# EAGLE design BminiMO (EAGLE 6.6.0)
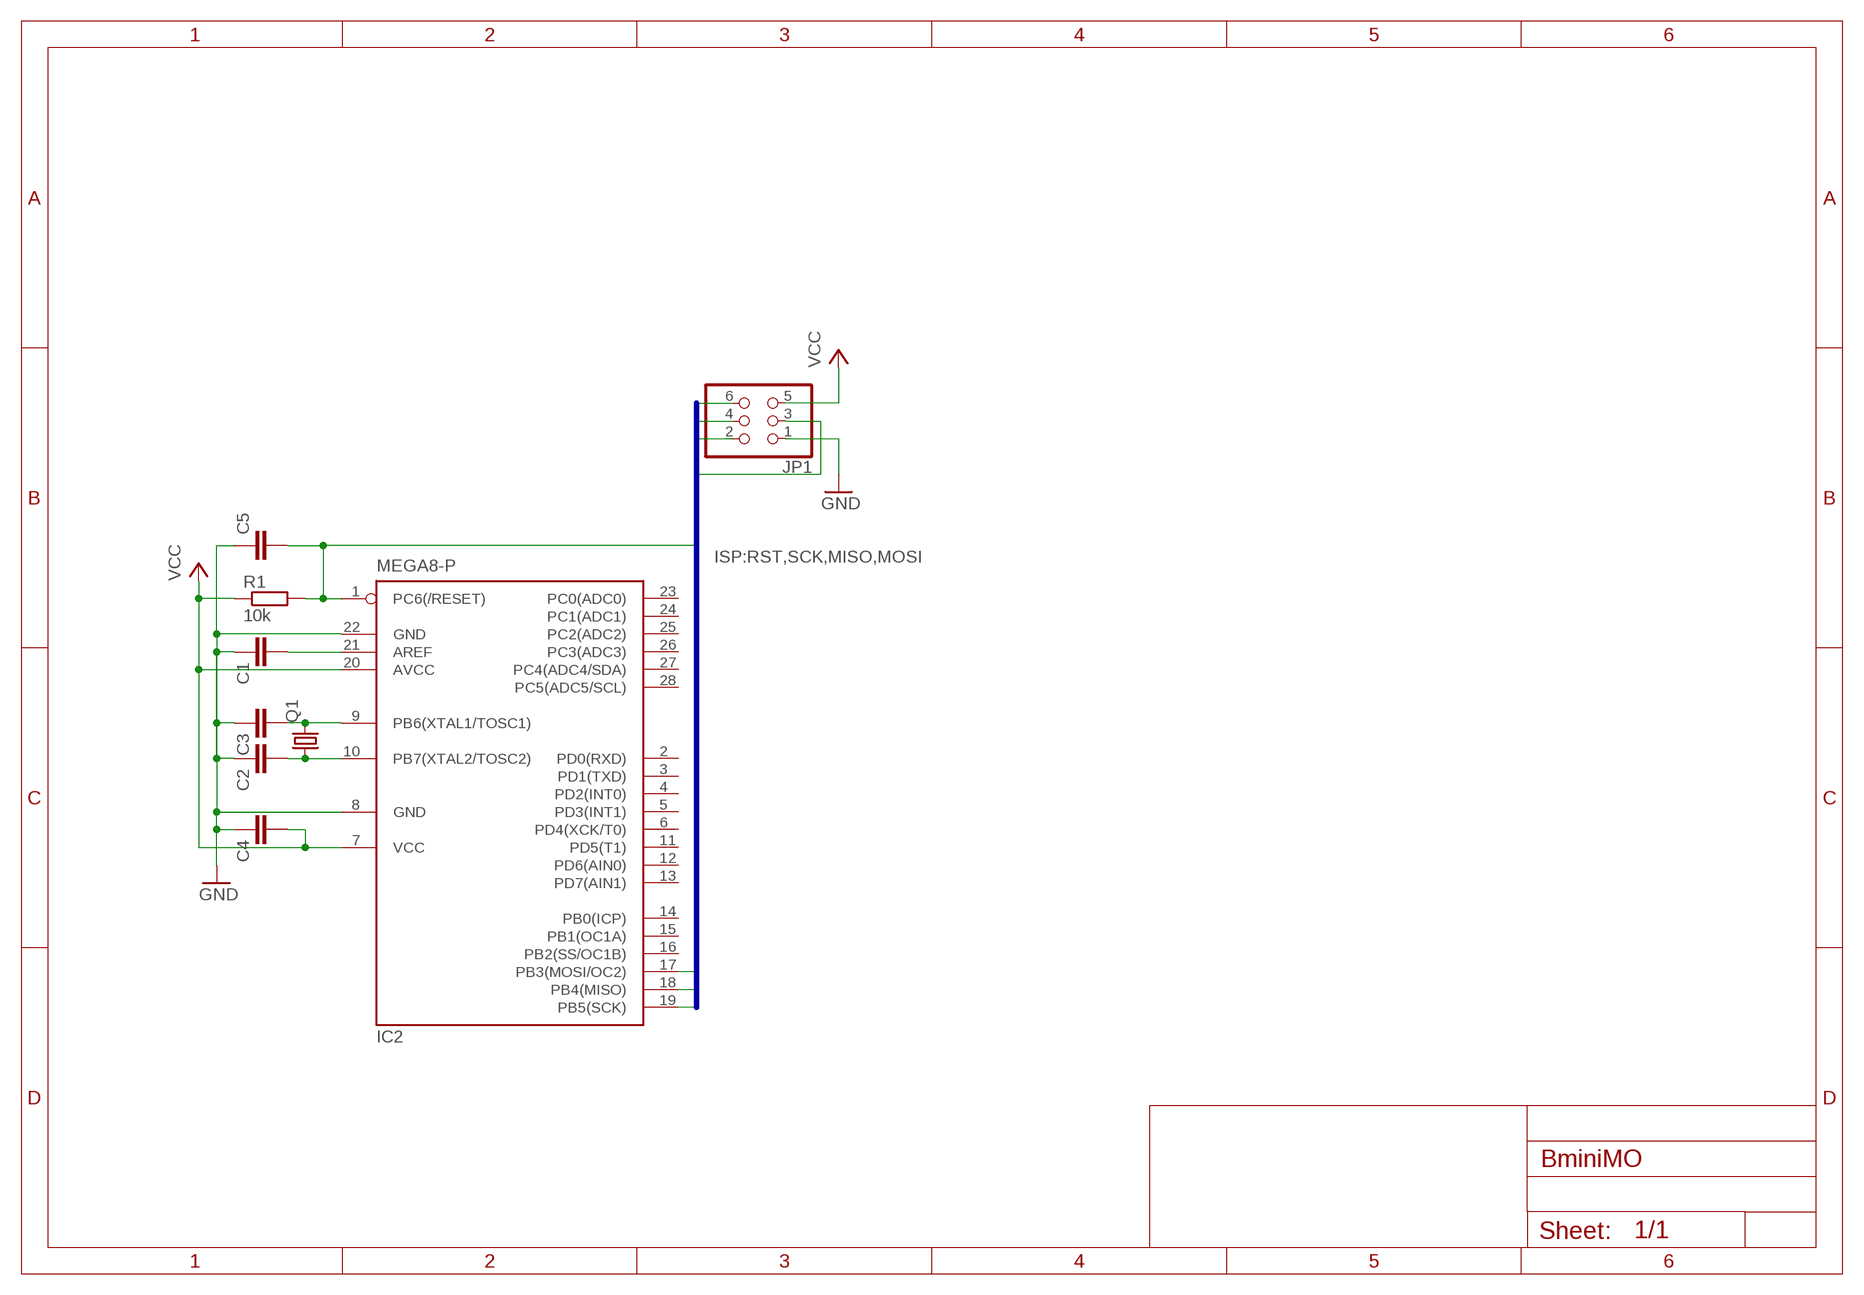
[diagram p0: schematic, sheet 1]

## Parts
C1  C-EU025-025X050  [C025-025X050]
C2  C-EU025-025X050  [C025-025X050]
C3  C-EU025-025X050  [C025-025X050]
C4  C-EU025-025X050  [C025-025X050]
C5  C-EU025-025X050  [C025-025X050]
IC2  MEGA8-P  [DIL28-3]
JP1  PINHD-2X3/90  [2X03/90]
Q1  CRYSTALHC49U-V  [HC49U-V]
R1  10k  R-EU_0207/10  [0207/10]

## Nets
GND: C1.1 C2.1 C3.1 C4.1 C5.1 IC2.8(GND) IC2.22(GND) JP1.1
MISO: IC2.18(PB4(MISO)) JP1.6
MOSI: IC2.17(PB3(MOSI/OC2)) JP1.3
N$1: C3.2 IC2.9(PB6(XTAL1/TOSC1)) Q1.2
N$2: C2.2 IC2.10(PB7(XTAL2/TOSC2)) Q1.1
N$3: C1.2 IC2.21(AREF)
RST: C5.2 IC2.1(PC6(/RESET)) JP1.2 R1.2
SCK: IC2.19(PB5(SCK)) JP1.4
VCC: C4.2 IC2.7(VCC) IC2.20(AVCC) JP1.5 R1.1
Unconnected: IC2.2(PD0(RXD)) IC2.3(PD1(TXD)) IC2.4(PD2(INT0)) IC2.5(PD3(INT1)) IC2.6(PD4(XCK/T0)) IC2.11(PD5(T1)) IC2.12(PD6(AIN0)) IC2.13(PD7(AIN1)) IC2.14(PB0(ICP)) IC2.15(PB1(OC1A)) IC2.16(PB2(SS/OC1B)) IC2.23(PC0(ADC0)) IC2.24(PC1(ADC1)) IC2.25(PC2(ADC2)) IC2.26(PC3(ADC3)) IC2.27(PC4(ADC4/SDA)) IC2.28(PC5(ADC5/SCL))

## Buses
ISP:RST,SCK,MISO,MOSI

## Library data of the parts
C1-C5 = rcl:C-EU: CAPACITOR, European symbol
IC2 = atmel:MEGA8-P: MICROCONTROLLER 8 Kbytes FLASH, 1 kbytes SRAM, 512 bytes EEPROM, USART, 4-channel 10 bit ADC, 2-channel 8 bit ADC Pin compatible with Atmega48, ATMega88, ATMega168 Source: avr.lbr; OC_FARNELL: unknown; OC_NEWARK: unknown
JP1 = pinhead:PINHD-2X3: PIN HEADER
Q1 = crystal:CRYSTAL: CRYSTAL; OC_FARNELL: 1666969; OC_NEWARK: unknown
R1 = rcl:R-EU_: RESISTOR, European symbol

## Board
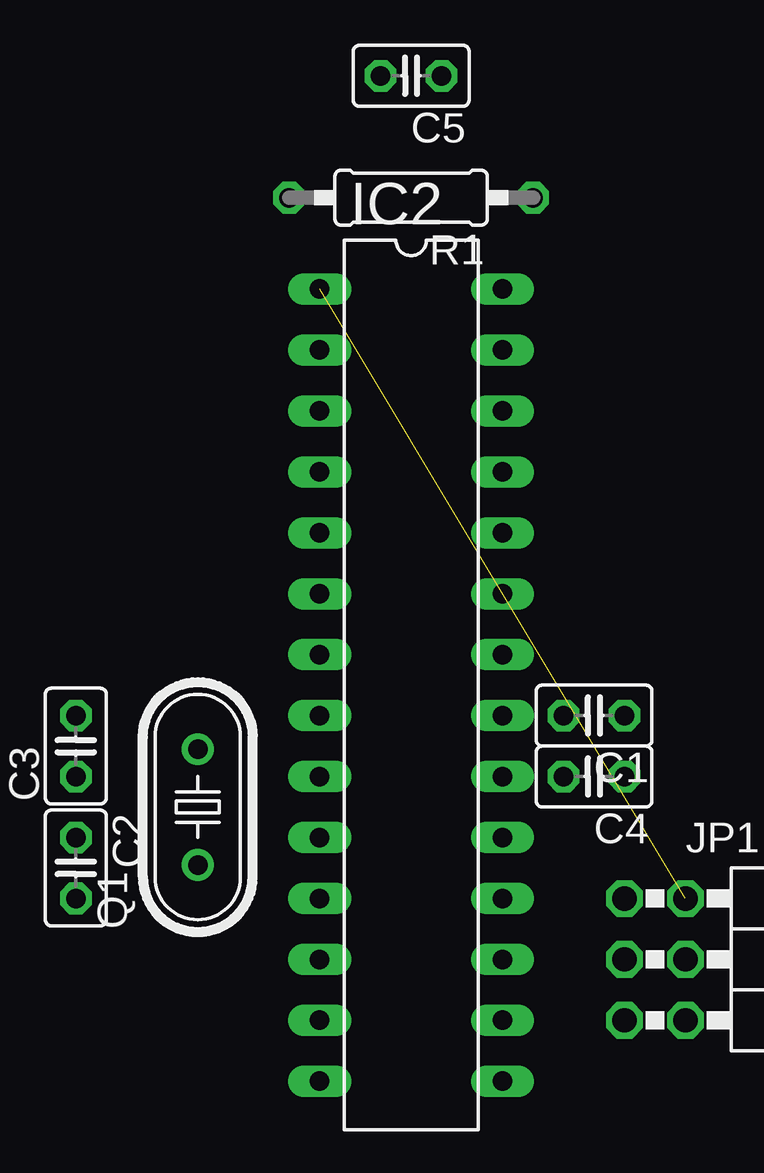
[diagram p1: board, top side]
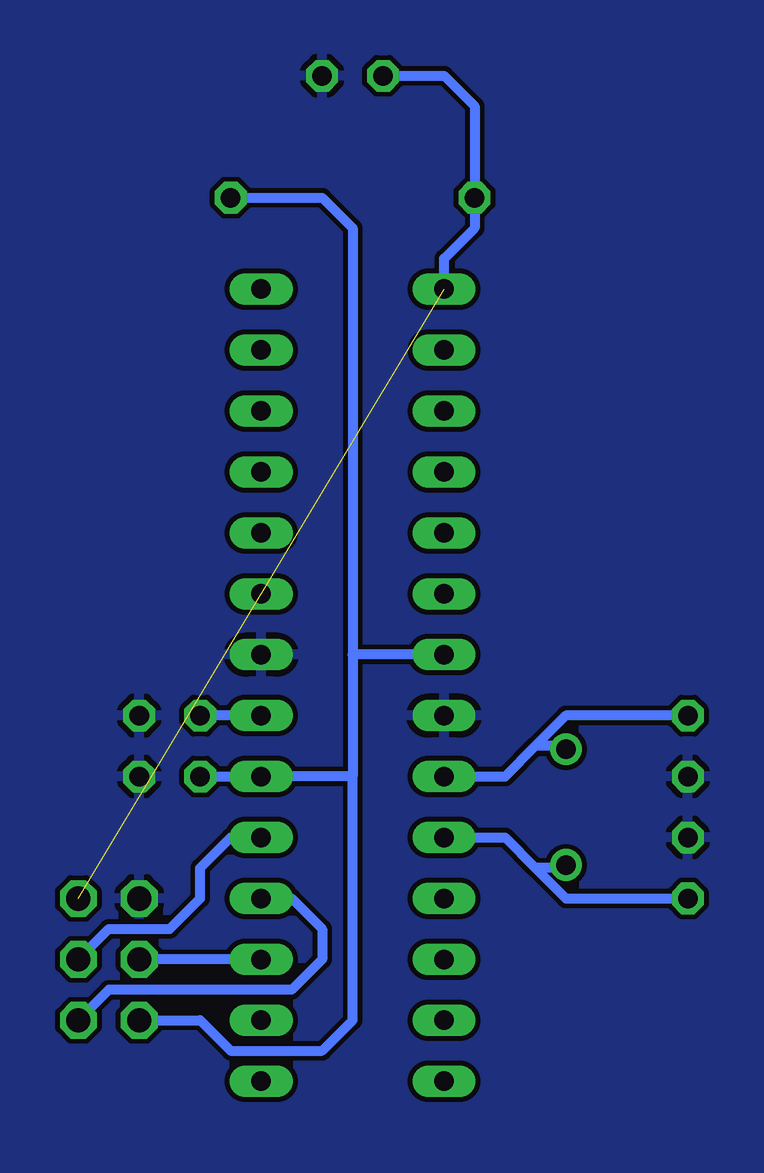
[diagram p2: board, bottom side, seen from below]

No outline drawn. Coordinates in mm, seen from the top.
Copper layers (1*16): Top 0.035mm / dielectric 1.5mm / Bottom 0.035mm
Design rules "default": minimum track width 10mil, minimum drill 24mil, track to track 8mil, track to pad 8mil, pad to pad 8mil, via to via 8mil, smd to smd 8mil, copper to edge 40mil, drill to drill 8mil, minimum pad ring 10mil, minimum via ring 8mil, stop-mask expansion 4mil, vias tented up to drill 0mil, thermal gap 10mil

### Footprints (pad centres in the part's own frame; a part is rotated, then mirrored left to right if it is on the bottom)
C025-025X050 = drill 0.813 octagon: 1 -1.27,0; 2 1.27,0
DIL28-3 = drill 0.813 long: 1 -16.51,-3.81; 2 -13.97,-3.81; 3 -11.43,-3.81; 4 -8.89,-3.81; 5 -6.35,-3.81; 6 -3.81,-3.81; 7 -1.27,-3.81; 8 1.27,-3.81; 9 3.81,-3.81; 10 6.35,-3.81; 11 8.89,-3.81; 12 11.43,-3.81; 13 13.97,-3.81; 14 16.51,-3.81; 15 16.51,3.81; 16 13.97,3.81; 17 11.43,3.81; 18 8.89,3.81; 19 6.35,3.81; 20 3.81,3.81; 21 1.27,3.81; 22 -1.27,3.81; 23 -3.81,3.81; 24 -6.35,3.81; 25 -8.89,3.81; 26 -11.43,3.81; 27 -13.97,3.81; 28 -16.51,3.81
2X03/90 = drill 1.016 octagon: 1 -2.54,-6.35; 2 -2.54,-3.81; 3 0,-6.35; 4 0,-3.81; 5 2.54,-6.35; 6 2.54,-3.81
HC49U-V = drill 0.813: 1 -2.413,0; 2 2.413,0
0207/10 = drill 0.813 octagon: 1 -5.08,0; 2 5.08,0

### Placement (x,y rotation side)
C1  38.1,39.37 180 top
C2  16.51,33.02 270 top
C3  16.51,38.1 90 top
C4  38.1,36.83 180 top
C5  30.48,66.04 180 top
IC2  30.48,40.64 270 top
JP1  45.72,29.21 270 top
Q1  21.59,35.56 90 top
R1  30.48,60.96 180 top

### Tracks (layer width: path | path; a pad name or v marks a point on that pad's centre or on a via)
GND
  pour Bottom: 10.16,5.08 85.09,5.08 85.09,81.28 10.16,81.28
MISO
  Bottom 0.406: IC2.18 33.02,31.75 31.75,30.48 31.75,29.21 33.02,27.94 40.64,27.94 JP1.6
MOSI
  Bottom 0.406: IC2.17 JP1.3
N$1
  Bottom 0.406: IC2.9 24.13,36.83 22.86,38.1 | Q1.2 21.59,38.1 22.86,38.1 | C3.2 21.59,39.37 22.86,38.1
N$2
  Bottom 0.406: IC2.10 24.13,34.29 22.86,33.02 | Q1.1 21.59,33.02 22.86,33.02 | 22.86,33.02 21.59,31.75 C2.2
N$3
  Bottom 0.406: IC2.21 C1.2
RST  (1 unrouted)
  Bottom 0.406: IC2.1 26.67,58.42 25.4,59.69 R1.2 25.4,64.77 26.67,66.04 C5.2
SCK
  Bottom 0.406: JP1.4 40.64,30.48 38.1,30.48 36.83,31.75 36.83,33.02 35.56,34.29 IC2.19
VCC
  Bottom 0.406: IC2.7 30.48,41.91 | 30.48,41.91 30.48,36.83 | 30.48,36.83 IC2.20 C4.2 | R1.1 31.75,60.96 30.48,59.69 30.48,41.91 | JP1.5 36.83,26.67 35.56,25.4 31.75,25.4 30.48,26.67 30.48,36.83